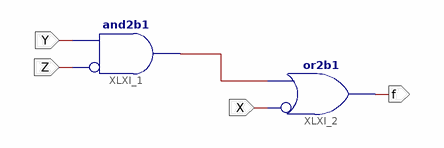
[diagram p0: schematic sheet 1]
// Xilinx ISE schematic circuitoF.sch (spartan3e) as structural Verilog: 2 symbols, 4 ports
module circuitoF (
  input  Y,
  input  Z,
  input  X,
  output f
);

  wire XLXN_5;

  and XLXI_1 (XLXN_5, ~Z, Y);  // and2b1
  or XLXI_2 (f, ~X, XLXN_5);  // or2b1
endmodule
